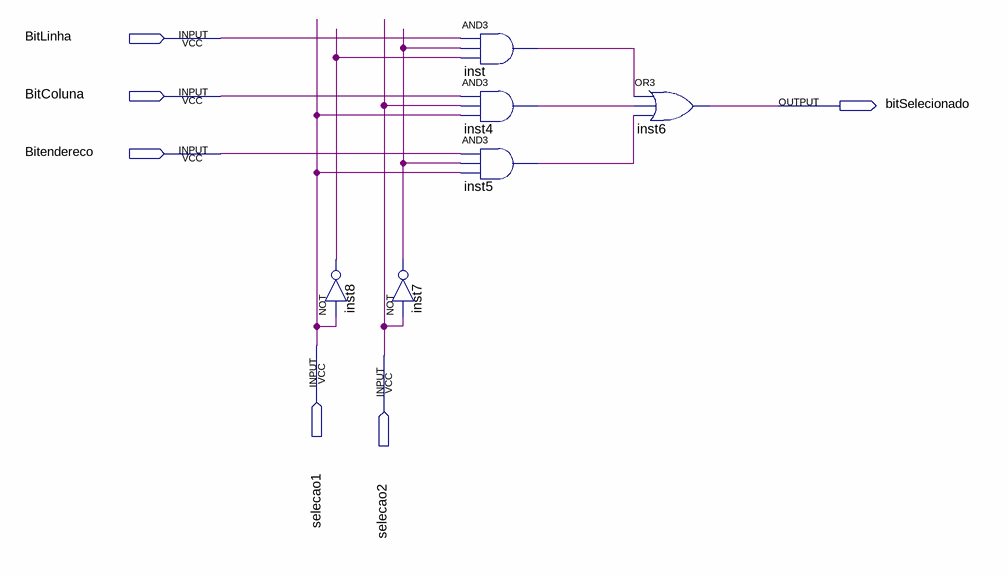
[diagram p0: schematic sheet]
// Quartus schematic mux3x1.bdf as structural Verilog: 6 symbols, 6 pins
module mux3x1 (
  input  BitLinha,
  input  BitColuna,
  input  Bitendereco,
  input  selecao1,
  input  selecao2,
  output bitSelecionado
);

  wire inst4_out, inst5_out, inst7_out, inst8_out, inst_out;

  not inst8 (inst8_out, selecao1);
  not inst7 (inst7_out, selecao2);
  and inst (inst_out, BitLinha, inst7_out, inst8_out);
  and inst4 (inst4_out, BitColuna, selecao2, selecao1);
  and inst5 (inst5_out, Bitendereco, inst7_out, selecao1);
  or inst6 (bitSelecionado, inst_out, inst4_out, inst5_out);
endmodule
